# EAGLE design Firefly Mainboard (EAGLE 8.2.0)
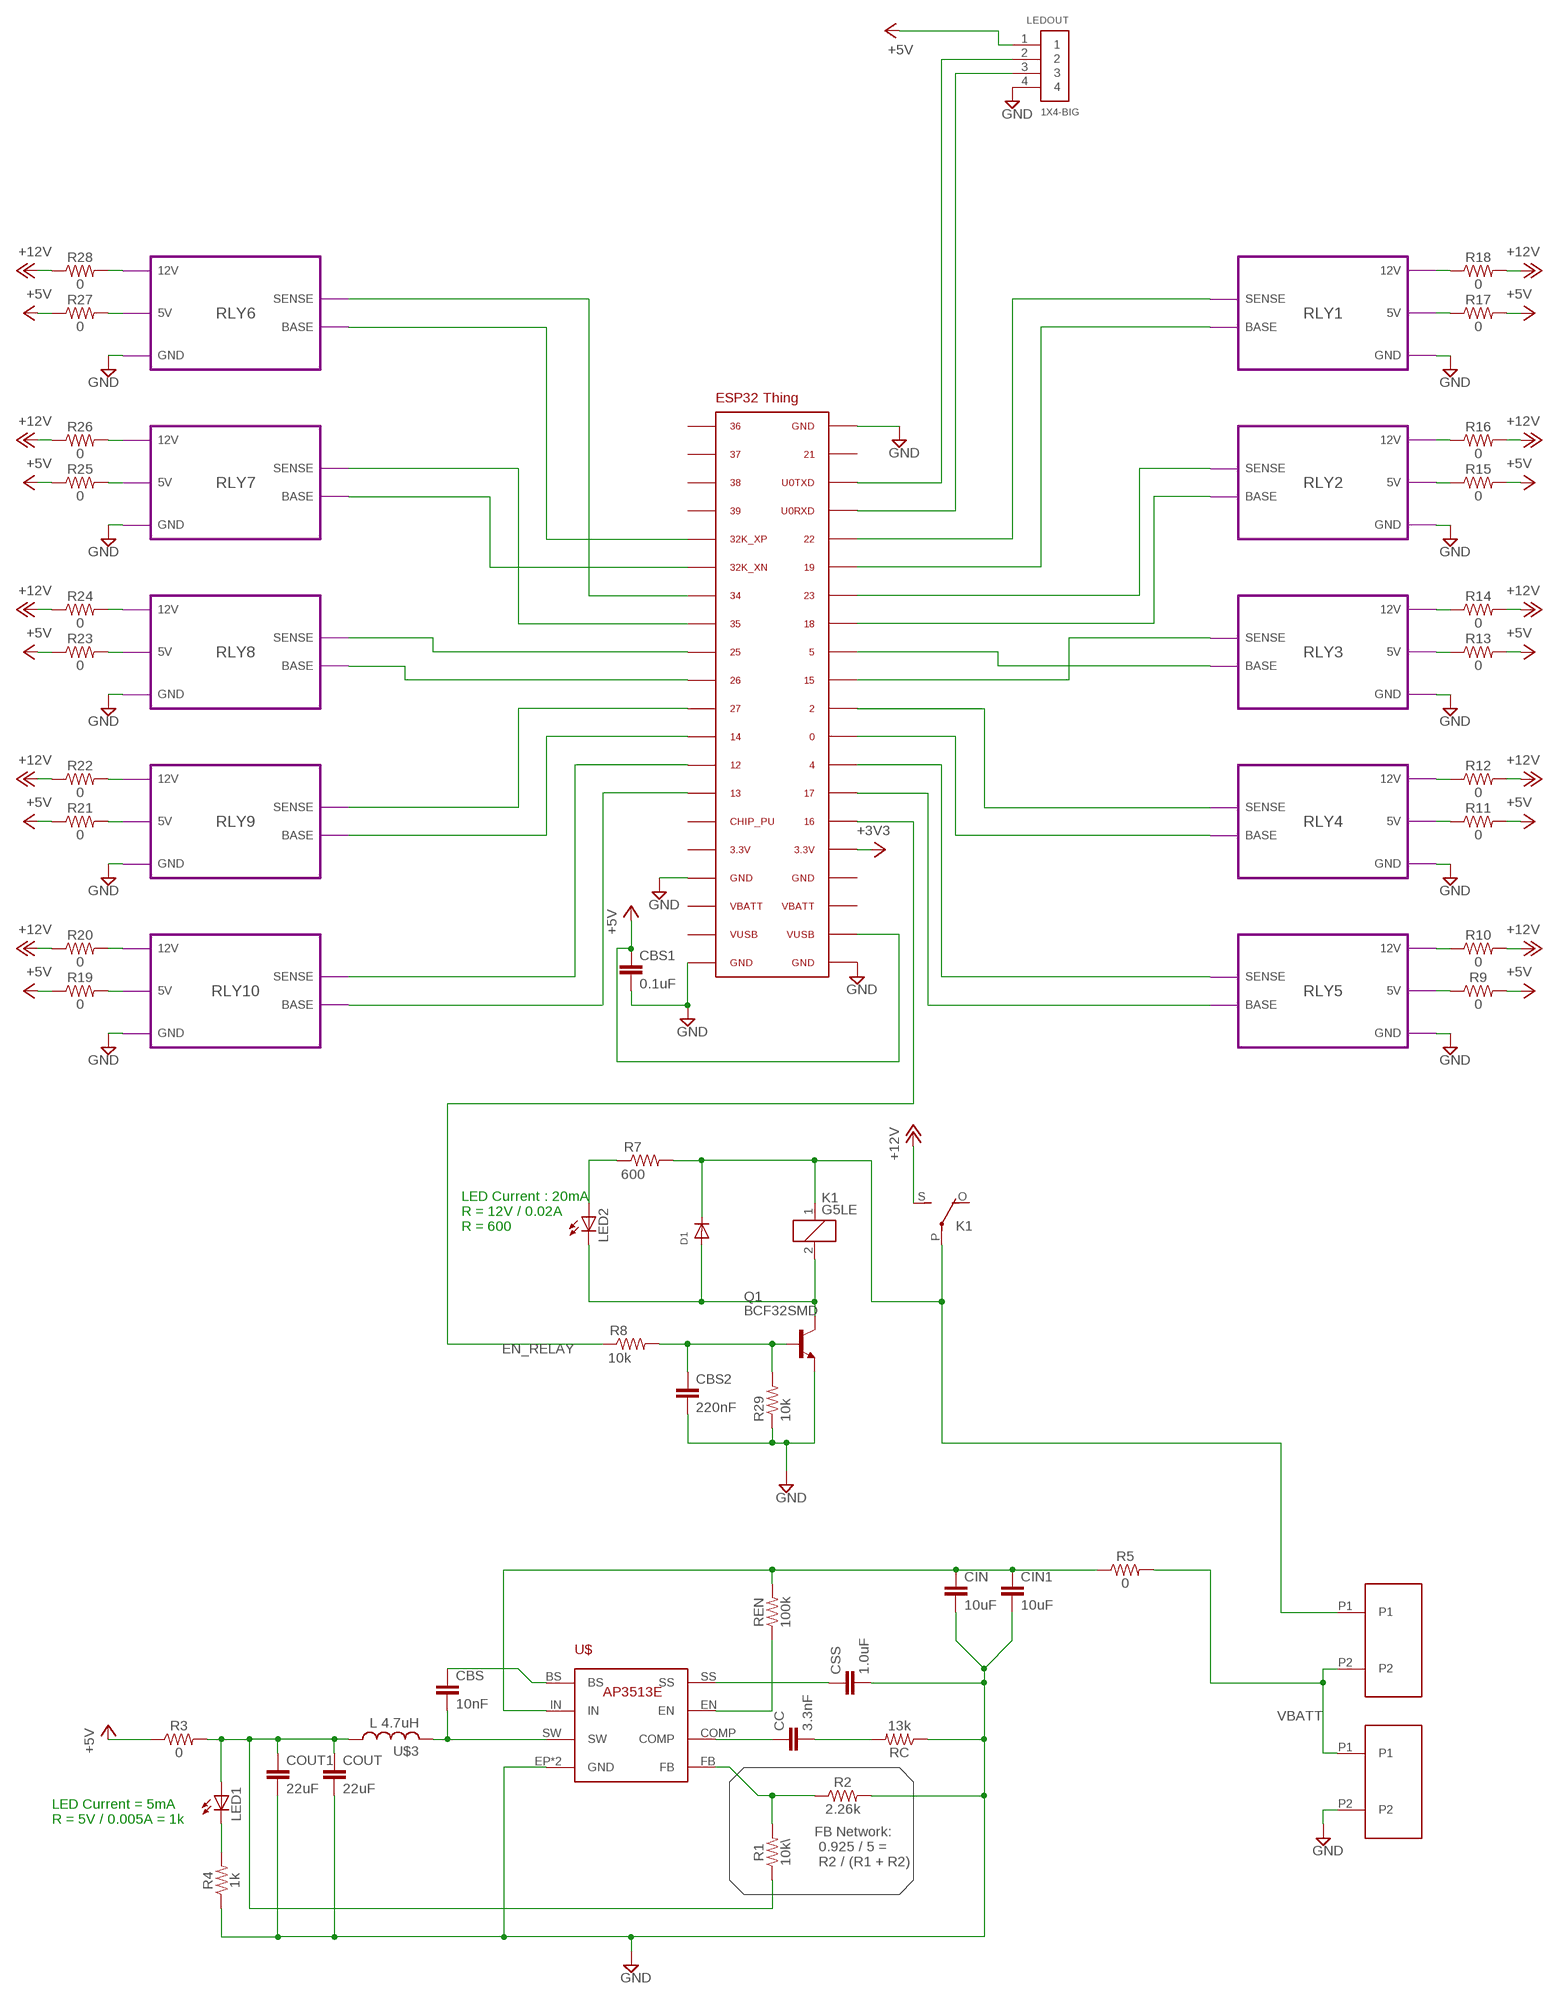
[diagram p0: schematic, sheet 1]

## Parts
CBS  10nF  1.0UF-1206-50V-10%  [1206]
CBS1  0.1uF  1.0UF-1206-50V-10%  [1206]
CBS2  220nF  1.0UF-1206-50V-10%  [1206]
CC  3.3nF  1.0UF-1206-50V-10%  [1206]
CIN  10uF  1.0UF-1206-50V-10%  [1206]
CIN1  10uF  1.0UF-1206-50V-10%  [1206]
COUT  22uF  1.0UF-1206-50V-10%  [1206]
COUT1  22uF  1.0UF-1206-50V-10%  [1206]
CSS  1.0uF  1.0UF-1206-50V-10%  [1206]
D1  DIODESMA  [SMADIODE]
K1  G5LE  [G5LE]
LED1  LED_ESML0603  [LED_SML0603]
LED2  LED_ESML0603  [LED_SML0603]
LEDOUT  1X4-BIG  [1X04-BIG]
Q1  BCF32SMD  [SOT23-BEC]
R1  10k\  1KOHM-0603-1/10W-1%  [0603]
R2  2.26k  1KOHM-0603-1/10W-1%  [0603]
R3  0  RESISTOR1206  [1206]
R4  1k  1KOHM-0603-1/10W-1%  [0603]
R5  0  RESISTOR1206  [1206]
R7  R-US_R0603  [R0603]
R8  R-US_R0603  [R0603]
R9  0  RESISTOR1206  [1206]
R10  0  RESISTOR1206  [1206]
R11  0  RESISTOR1206  [1206]
R12  0  RESISTOR1206  [1206]
R13  0  RESISTOR1206  [1206]
R14  0  RESISTOR1206  [1206]
R15  0  RESISTOR1206  [1206]
R16  0  RESISTOR1206  [1206]
R17  0  RESISTOR1206  [1206]
R18  0  RESISTOR1206  [1206]
R19  0  RESISTOR1206  [1206]
R20  0  RESISTOR1206  [1206]
R21  0  RESISTOR1206  [1206]
R22  0  RESISTOR1206  [1206]
R23  0  RESISTOR1206  [1206]
R24  0  RESISTOR1206  [1206]
R25  0  RESISTOR1206  [1206]
R26  0  RESISTOR1206  [1206]
R27  0  RESISTOR1206  [1206]
R28  0  RESISTOR1206  [1206]
R29  10k  R-US_R0603  [R0603]
RC  13k  1KOHM-0603-1/10W-1%  [0603]
REN  100k  1KOHM-0603-1/10W-1%  [0603]
U$1  ESP32_THING  [ESP32_THING]
U$2  AP3513E  [AP3513E]
U$3  L 4.7uH  LL1210  [R1210]
U$4  BATTERY_PADS  [BATTERY_PADS]
U$5  BATTERY_PADS  [BATTERY_PADS]

## Module instances
RLY1 = RELAY
RLY2 = RELAY
RLY3 = RELAY
RLY4 = RELAY
RLY5 = RELAY
RLY6 = RELAY
RLY7 = RELAY
RLY8 = RELAY
RLY9 = RELAY
RLY10 = RELAY

## Nets
+3V3: U$1.P$5
+5V: CBS1.1 LEDOUT.1 R3.1 R9.2 R11.2 R13.2 R15.2 R17.2 R19.1 R21.1 R23.1 R25.1 R27.1 U$1.P$2
+12V: K1.S(2:S) R10.2 R12.2 R14.2 R16.2 R18.2 R20.1 R22.1 R24.1 R26.1 R28.1
EN_RELAY: R8.1 U$1.P$6
GND: CBS1.2 CBS2.2 CIN1.2 CIN.2 COUT1.2 COUT.2 CSS.2 LEDOUT.4 Q1.E R2.2 R4.1 R29.1 RC.1 U$1.P$1 U$1.P$20 U$1.P$21 U$1.P$24 U$2.EP(GND) U$2.GND U$4.P2 ; port RLY1.GND RLY2.GND RLY3.GND RLY4.GND RLY5.GND RLY6.GND RLY7.GND RLY8.GND RLY9.GND RLY10.GND
N$1: R1.2 R2.1 U$2.FB
N$2: CC.1 U$2.COMP
N$3: CC.2 RC.2
N$4: CSS.1 U$2.SS
N$5: REN.1 U$2.EN
N$6: LEDOUT.2 U$1.P$18
N$7: CBS.2 U$2.SW U$3.2
N$8: CBS.1 U$2.BS
N$10: U$1.P$7 ; port RLY5.BASE
N$11: U$1.P$8 ; port RLY5.SENSE
N$12: U$1.P$9 ; port RLY4.BASE
N$13: U$1.P$10 ; port RLY4.SENSE
N$14: U$1.P$12 ; port RLY3.BASE
N$15: U$1.P$11 ; port RLY3.SENSE
N$16: U$1.P$13 ; port RLY2.BASE
N$17: U$1.P$14 ; port RLY2.SENSE
N$18: U$1.P$27 ; port RLY10.BASE
N$19: U$1.P$28 ; port RLY10.SENSE
N$20: U$1.P$29 ; port RLY9.BASE
N$21: U$1.P$30 ; port RLY9.SENSE
N$22: U$1.P$31 ; port RLY8.BASE
N$23: U$1.P$32 ; port RLY8.SENSE
N$24: U$1.P$35 ; port RLY7.BASE
N$25: U$1.P$33 ; port RLY7.SENSE
N$26: U$1.P$36 ; port RLY6.BASE
N$27: U$1.P$34 ; port RLY6.SENSE
N$28: COUT1.1 COUT.1 LED1.A R1.1 R3.2 U$3.1
N$29: LED1.C R4.2
N$30: D1.A K1.2 LED2.C Q1.C
N$31: U$1.P$15 ; port RLY1.BASE
N$32: CIN1.1 CIN.1 R5.1 REN.2 U$2.IN
N$34: LED2.A R7.1
N$35: R10.1 ; port RLY5.12V
N$36: R9.1 ; port RLY5.5V
N$37: R11.1 ; port RLY4.5V
N$38: R12.1 ; port RLY4.12V
N$39: R13.1 ; port RLY3.5V
N$40: R14.1 ; port RLY3.12V
N$41: R15.1 ; port RLY2.5V
N$42: R16.1 ; port RLY2.12V
N$43: R17.1 ; port RLY1.5V
N$44: R18.1 ; port RLY1.12V
N$45: R19.2 ; port RLY10.5V
N$46: R20.2 ; port RLY10.12V
N$47: R21.2 ; port RLY9.5V
N$48: R22.2 ; port RLY9.12V
N$49: R23.2 ; port RLY8.5V
N$50: R24.2 ; port RLY8.12V
N$51: R25.2 ; port RLY7.5V
N$52: R26.2 ; port RLY7.12V
N$53: R27.2 ; port RLY6.5V
N$54: R28.2 ; port RLY6.12V
N$55: U$1.P$16 ; port RLY1.SENSE
N$57: D1.C K1.1 K1.P(2:P) R7.2 U$5.P1
N$58: CBS2.1 Q1.B R8.2 R29.2
SCL: LEDOUT.3 U$1.P$17
VBATT: R5.2 U$4.P1 U$5.P2
Unconnected: K1.O(2:O) U$1.P$3 U$1.P$4 U$1.P$19 U$1.P$22 U$1.P$23 U$1.P$25 U$1.P$26 U$1.P$37 U$1.P$38 U$1.P$39 U$1.P$40

## Notes on the sheet
- LED Current : 20mA
  R = 12V / 0.02A 
  R = 600
- LED Current = 5mA
  R = 5V / 0.005A = 1k
- FB Network:
   0.925 / 5 =
   R2 / (R1 + R2)

## Library data of the parts
CBS CBS1 CBS2 CC CIN CIN1 COUT COUT1 = SparkFun-Capacitors:1.0UF: 1µF ceramic capacitors A capacitor is a passive two-terminal electrical component used to store electrical energy temporarily in an electric field.; PROD_ID: CAP-09822; VALUE: 1.0uF
CSS = SparkFun-Capacitors:1.0UF: 1µF ceramic capacitors A capacitor is a passive two-terminal electrical component used to store electrical energy temporarily in an electric field.; PROD_ID: CAP-09822
D1 = adafruit:DIODE: Diode SMADIODE - SMA Surface Mount Package 20V 1A Schottky Diode Digikey: 641-1014-6-ND DO-1N4148 - Through Hole Small Current Diode SOD-123 20V 1 A (.5mV Vf) Schottky Diode - Digikey: MBRX120TPMSCT-ND SOD-323 10V 570mA (.38mV Vf, 3ns) Schottky Diode - Digikey: ZLLS410CT-ND SOD-523 30V 30mA Schottky Diode (RB751S-40TE61) - Digikey: RB751S-40TE61CT-ND SOT23-R/W - SOT23 Package (R = Solder Paste/Reflow Ovens, W = Hand-Soldering) BAT54Film 40V 300mA - Digikey: 497-7162-1-ND
K1 = relay:G5LE: RELAY 1 x switch, 10 A/120 V AC, 8 A/30 V DC, Omron; OC_FARNELL: unknown; OC_NEWARK: unknown
LED1 LED2 = eagle-ltspice:LED_E: LED Source: http://www.osram.convergy.de Source: www.luxeon.com Source: www.kingbright.com; SPICEMODEL: NONE; SPICEPREFIX: D; SPICETYPE: diode
LEDOUT = adafruit:1X4: 4-pin connector
Q1 = transistor-npn:BCF32*: NPN Transistor
R1 R2 RC REN = SparkFun-Resistors:1KOHM: 1kΩ resistor A resistor is a passive two-terminal electrical component that implements electrical resistance as a circuit element. Resistors act to reduce current flow, and, at the same time, act to lower voltage levels within circuits. - Wikipedia; PROD_ID: RES-07856; VALUE: 1k
R3 R5 R9-R28 = SparkFun-Resistors:RESISTOR: Generic Resistor Package
R4 = SparkFun-Resistors:1KOHM: 1kΩ resistor A resistor is a passive two-terminal electrical component that implements electrical resistance as a circuit element. Resistors act to reduce current flow, and, at the same time, act to lower voltage levels within circuits. - Wikipedia; PROD_ID: RES-07856
R7 = resistor:R-US_: RESISTOR, American symbol; R1: 600
R8 = resistor:R-US_: RESISTOR, American symbol; R1: 10k
R29 = resistor:R-US_: RESISTOR, American symbol; R1: 1k
U$1 = Mylib:ESP32_THING: Sparkfun ESP32 Thing Wifi module with LiPo charger
U$2 = Mylib:AP3513E
U$3 = adafruit:L
U$4 U$5 = Mylib:BATTERY_PADS

## Module RELAY
Ports: SENSE(io) GND(io) 5V(io) 12V(io) BASE(io)
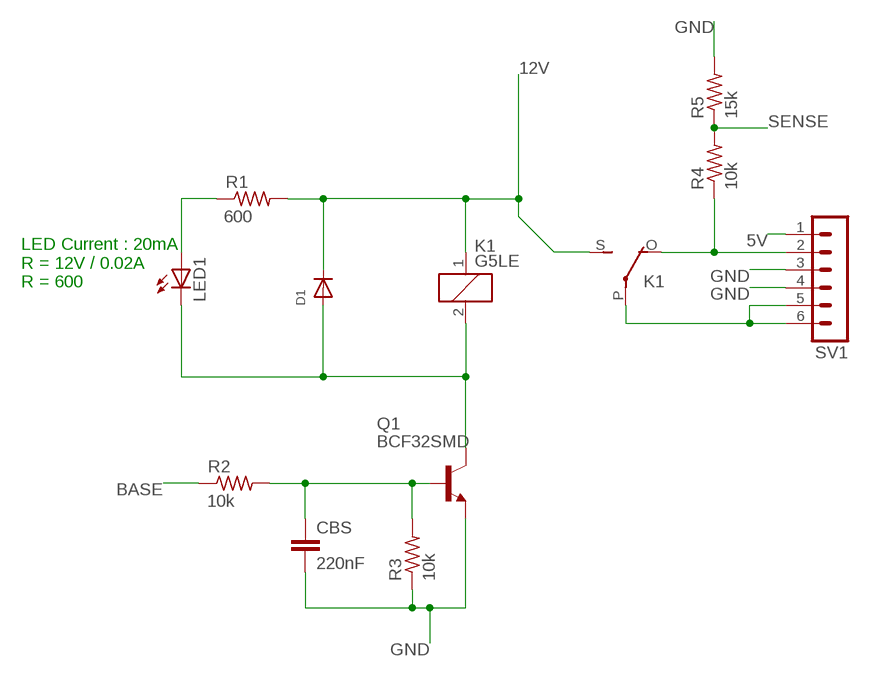
[diagram p1: schematic, module RELAY, sheet 1]

### Parts
CBS  220nF  1.0UF-1206-50V-10%  [1206]
D1  DIODESMA  [SMADIODE]
K1  G5LE  [G5LE]
LED1  LED_ESML0603  [LED_SML0603]
Q1  BCF32SMD  [SOT23-BEC]
R1  R-US_R0603  [R0603]
R2  R-US_R0603  [R0603]
R3  10k  R-US_R0603  [R0603]
R4  10k  R-US_R0603  [R0603]
R5  15k  R-US_R0603  [R0603]
SV1  MA06-1  [MA06-1]

### Nets
5V: SV1.1
12V: D1.C K1.1 K1.S(2:S) R1.2
BASE: R2.1
GND: CBS.2 Q1.E R3.1 R5.2 SV1.3 SV1.4
N$1: LED1.A R1.1
N$2: K1.P(2:P) SV1.5 SV1.6
N$3: CBS.1 Q1.B R2.2 R3.2
N$4: D1.A K1.2 LED1.C Q1.C
N$6: K1.O(2:O) R4.1 SV1.2
SENSE: R4.2 R5.1

### Notes on the sheet
- LED Current : 20mA
  R = 12V / 0.02A 
  R = 600

### Library data of the parts
CBS = SparkFun-Capacitors:1.0UF: 1µF ceramic capacitors A capacitor is a passive two-terminal electrical component used to store electrical energy temporarily in an electric field.; PROD_ID: CAP-09822; VALUE: 1.0uF
D1 = adafruit:DIODE: Diode SMADIODE - SMA Surface Mount Package 20V 1A Schottky Diode Digikey: 641-1014-6-ND DO-1N4148 - Through Hole Small Current Diode SOD-123 20V 1 A (.5mV Vf) Schottky Diode - Digikey: MBRX120TPMSCT-ND SOD-323 10V 570mA (.38mV Vf, 3ns) Schottky Diode - Digikey: ZLLS410CT-ND SOD-523 30V 30mA Schottky Diode (RB751S-40TE61) - Digikey: RB751S-40TE61CT-ND SOT23-R/W - SOT23 Package (R = Solder Paste/Reflow Ovens, W = Hand-Soldering) BAT54Film 40V 300mA - Digikey: 497-7162-1-ND
K1 = relay:G5LE: RELAY 1 x switch, 10 A/120 V AC, 8 A/30 V DC, Omron; OC_FARNELL: unknown; OC_NEWARK: unknown
LED1 = eagle-ltspice:LED_E: LED Source: http://www.osram.convergy.de Source: www.luxeon.com Source: www.kingbright.com; SPICEMODEL: NONE; SPICEPREFIX: D; SPICETYPE: diode
Q1 = transistor-npn:BCF32*: NPN Transistor
R1 = resistor:R-US_: RESISTOR, American symbol; R1: 600
R2 = resistor:R-US_: RESISTOR, American symbol; R1: 10k
R3-R5 = resistor:R-US_: RESISTOR, American symbol; R1: 1k
SV1 = con-lstb:MA06-1: PIN HEADER; OC_FARNELL: unknown; OC_NEWARK: unknown

## Module RELAY2
Ports: 

### Library data of the parts

## Board
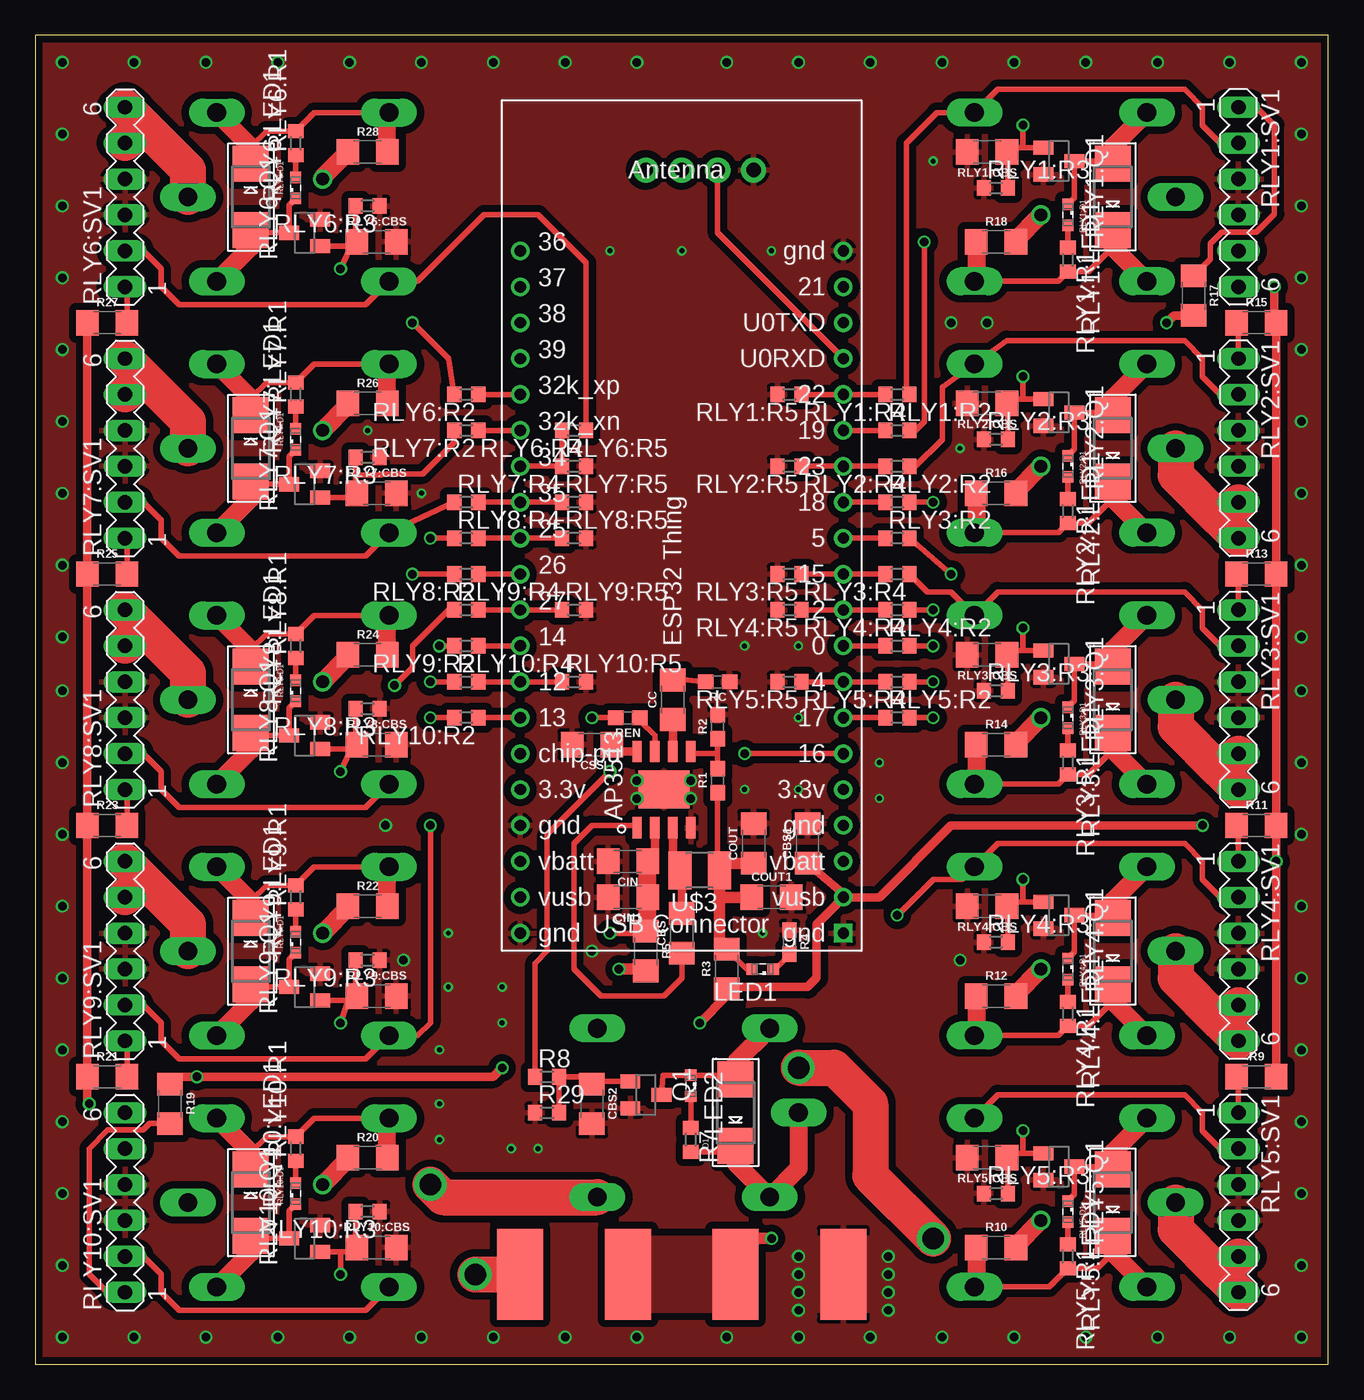
[diagram p2: board, top side]
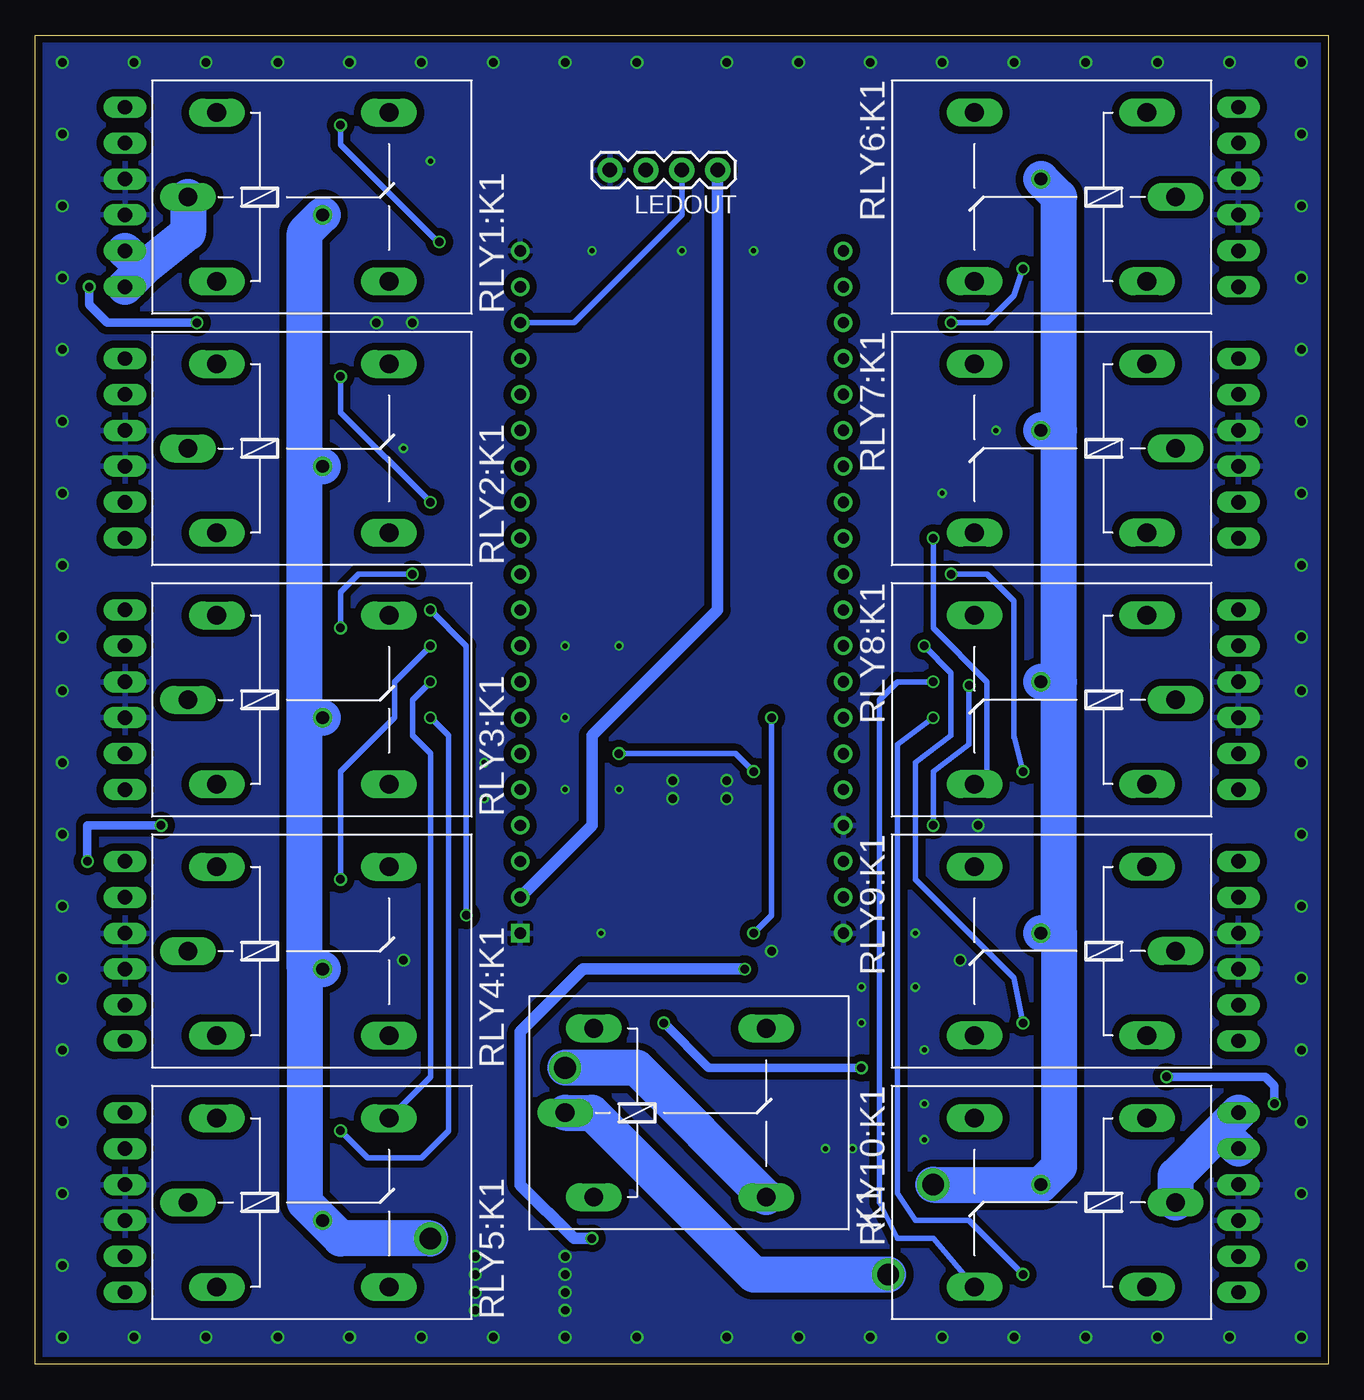
[diagram p3: board, bottom side, seen from below]

Size 91.44 x 93.98 mm. Coordinates in mm from the lower left corner, seen from the top.
Outline: 0,0 91.44,0 91.44,93.98 0,93.98 0,0
Copper layers (1*16): Top 0.035mm / dielectric 1.5mm / Bottom 0.035mm
Design rules "SeeedStudio_2layer_DRU_no_angle_20140221 *": minimum track width 6mil, minimum drill 12mil, track to track 10mil, track to pad 10mil, pad to pad 10mil, via to via 10mil, smd to smd 0mil, copper to edge 10mil, drill to drill 10mil, minimum pad ring 10mil, minimum via ring 6mil, stop-mask expansion 2mil, vias tented up to drill 100mil, thermal gap 10mil

### Footprints (pad centres in the part's own frame; a part is rotated, then mirrored left to right if it is on the bottom)
1206 = smd 1.6 x 1.8: 1 -1.4,0; 2 1.4,0
SMADIODE = smd 2.54 x 2.54: A 2.349,0; C -2.349,0
G5LE = drill 1.321 long: 1 -7.493,-5.969; 2 -7.493,5.969; O 4.699,5.969; P -9.525,0; S 4.699,-5.969
LED_SML0603 = smd 0.8 x 0.8: A 0.75,0; C -0.75,0
1X04-BIG = drill 1.016 pad 1.778: 1 0,0; 2 2.54,0; 3 5.08,0; 4 7.62,0
SOT23-BEC = smd 1 x 1.4: B -0.95,-1.1; C 0,1.1; E 0.95,-1.1
0603 = smd 1.1 x 1: 1 -0.85,0; 2 0.85,0
R0603 = smd 1 x 1.1: 1 -0.85,0; 2 0.85,0
MA06-1 = drill 1.016 long: 1 -6.35,0; 2 -3.81,0; 3 -1.27,0; 4 1.27,0; 5 3.81,0; 6 6.35,0
ESP32_THING = drill 0.8 square: P$1 0,0 | drill 0.8: P$2 0,2.54; P$3 0,5.08; P$4 0,7.62; P$5 0,10.16; P$6 0,12.7; P$7 0,15.24; P$8 0,17.78; P$9 0,20.32; P$10 0,22.86; P$11 0,25.4; P$12 0,27.94; P$13 0,30.48; P$14 0,33.02; P$15 0,35.56; P$16 0,38.1; P$17 0,40.64; P$18 0,43.18; P$19 0,45.72; P$20 0,48.26; P$21 -22.86,0; P$22 -22.86,2.54; P$23 -22.86,5.08; P$24 -22.86,7.62; P$25 -22.86,10.16; P$26 -22.86,12.7; P$27 -22.86,15.24; P$28 -22.86,17.78; P$29 -22.86,20.32; P$30 -22.86,22.86; P$31 -22.86,25.4; P$32 -22.86,27.94; P$33 -22.86,30.48; P$34 -22.86,33.02; P$35 -22.86,35.56; P$36 -22.86,38.1; P$37 -22.86,40.64; P$38 -22.86,43.18; P$39 -22.86,45.72; P$40 -22.86,48.26
AP3513E = smd 1.5 x 0.65: BS -2.7,1.905; COMP 2.7,-0.635; EN 2.7,0.635; FB 2.7,-1.905; GND -2.7,-1.905; IN -2.7,0.635; SS 2.7,1.905; SW -2.7,-0.635 | smd 2.7 x 3.6: EP 0,0
R1210 = smd 1.6 x 2.7: 1 -1.4,0; 2 1.4,0
BATTERY_PADS = smd 3.251 x 6.452: P1 -3.81,0; P2 3.81,0

### Placement (x,y rotation side)
CBS  45.72,30.48 90 top
CBS1  54.61,36.83 90 top
CBS2  39.37,18.41 270 top
CC  45.09,46.99 90 top
CIN  41.91,35.56 180 top
CIN1  41.91,33.02 180 top
COUT  50.8,36.83 90 top
COUT1  52.07,33.02 0 top
CSS  39.37,43.81 180 top
D1  49.53,17.78 90 top
K1  44.45,17.78 0 bottom
LED1  51.44,27.94 180 top
LED2  46.35,19.68 270 top
LEDOUT  43.18,84.45 180 bottom
Q1  43.18,19.05 270 top
R1  48.26,41.27 90 top
R2  48.26,45.09 90 top
R3  48.9,27.94 90 top
R4  53.34,29.84 270 top
R5  43.18,29.21 270 top
R7  46.35,15.88 270 top
R8  36.2,20.32 0 top
R9  86.36,20.32 0 top
R10  67.94,8.26 0 top
R11  86.36,38.1 0 top
R12  67.94,26.04 0 top
R13  86.36,55.88 0 top
R14  67.94,43.81 0 top
R15  86.36,73.66 0 top
R16  67.94,61.59 0 top
R17  81.92,75.56 270 top
R18  67.94,79.38 0 top
R19  9.53,18.41 270 top
R20  23.5,14.61 0 top
R21  5.08,20.32 0 top
R22  23.5,32.38 0 top
R23  5.08,38.1 0 top
R24  23.5,50.16 0 top
R25  5.08,55.88 0 top
R26  23.5,67.94 0 top
R27  5.08,73.66 0 top
R28  23.5,85.72 0 top
R29  36.2,17.78 0 top
RC  48.26,48.26 180 top
REN  41.91,45.72 180 top
RLY1:CBS  220nF  [1206]  67.31,85.72 180 top
RLY1:D1  [SMADIODE]  76.2,82.55 90 top
RLY1:K1  G5LE  [G5LE]  71.12,82.55 0 bottom
RLY1:LED1  [LED_SML0603]  73.03,81.28 270 top
RLY1:Q1  BCF32SMD  [SOT23-BEC]  72.39,85.09 270 top
RLY1:R1  [R0603]  73.03,78.11 270 top
RLY1:R2  [R0603]  60.96,66.04 0 top
RLY1:R3  10k  [R0603]  67.94,83.19 0 top
RLY1:R4  10k  [R0603]  60.96,68.58 180 top
RLY1:R5  15k  [R0603]  53.34,68.58 180 top
RLY1:SV1  [MA06-1]  85.09,82.55 270 top
RLY2:CBS  220nF  [1206]  67.31,67.94 180 top
RLY2:D1  [SMADIODE]  76.2,64.77 90 top
RLY2:K1  G5LE  [G5LE]  71.12,64.77 0 bottom
RLY2:LED1  [LED_SML0603]  73.03,63.5 270 top
RLY2:Q1  BCF32SMD  [SOT23-BEC]  72.39,67.31 270 top
RLY2:R1  [R0603]  73.03,60.33 270 top
RLY2:R2  [R0603]  60.96,60.96 0 top
RLY2:R3  10k  [R0603]  67.94,65.41 0 top
RLY2:R4  10k  [R0603]  60.96,63.5 180 top
RLY2:R5  15k  [R0603]  53.34,63.5 180 top
RLY2:SV1  [MA06-1]  85.09,64.77 270 top
RLY3:CBS  220nF  [1206]  67.31,50.16 180 top
RLY3:D1  [SMADIODE]  76.2,46.99 90 top
RLY3:K1  G5LE  [G5LE]  71.12,46.99 0 bottom
RLY3:LED1  [LED_SML0603]  73.03,45.72 270 top
RLY3:Q1  BCF32SMD  [SOT23-BEC]  72.39,49.53 270 top
RLY3:R1  [R0603]  73.03,42.55 270 top
RLY3:R2  [R0603]  60.96,58.42 0 top
RLY3:R3  10k  [R0603]  67.94,47.62 0 top
RLY3:R4  10k  [R0603]  60.96,55.88 180 top
RLY3:R5  15k  [R0603]  53.34,55.88 180 top
RLY3:SV1  [MA06-1]  85.09,46.99 270 top
RLY4:CBS  220nF  [1206]  67.31,32.38 180 top
RLY4:D1  [SMADIODE]  76.2,29.21 90 top
RLY4:K1  G5LE  [G5LE]  71.12,29.21 0 bottom
RLY4:LED1  [LED_SML0603]  73.03,27.94 270 top
RLY4:Q1  BCF32SMD  [SOT23-BEC]  72.39,31.75 270 top
RLY4:R1  [R0603]  73.03,24.77 270 top
RLY4:R2  [R0603]  60.96,50.8 0 top
RLY4:R3  10k  [R0603]  67.94,29.84 0 top
RLY4:R4  10k  [R0603]  60.96,53.34 180 top
RLY4:R5  15k  [R0603]  53.34,53.34 180 top
RLY4:SV1  [MA06-1]  85.09,29.21 270 top
RLY5:CBS  220nF  [1206]  67.31,14.61 180 top
RLY5:D1  [SMADIODE]  76.2,11.43 90 top
RLY5:K1  G5LE  [G5LE]  71.12,11.43 0 bottom
RLY5:LED1  [LED_SML0603]  73.03,10.79 270 top
RLY5:Q1  BCF32SMD  [SOT23-BEC]  72.39,13.97 270 top
RLY5:R1  [R0603]  73.03,7.62 270 top
RLY5:R2  [R0603]  60.96,45.72 0 top
RLY5:R3  10k  [R0603]  67.94,12.06 0 top
RLY5:R4  10k  [R0603]  60.96,48.26 180 top
RLY5:R5  15k  [R0603]  53.34,48.26 180 top
RLY5:SV1  [MA06-1]  85.09,11.43 270 top
RLY6:CBS  220nF  [1206]  24.13,79.38 0 top
RLY6:D1  [SMADIODE]  15.24,82.55 270 top
RLY6:K1  G5LE  [G5LE]  20.32,82.55 180 bottom
RLY6:LED1  [LED_SML0603]  18.41,83.19 90 top
RLY6:Q1  BCF32SMD  [SOT23-BEC]  19.05,80.01 90 top
RLY6:R1  [R0603]  18.41,86.36 90 top
RLY6:R2  [R0603]  30.48,68.58 180 top
RLY6:R3  10k  [R0603]  23.5,81.92 180 top
RLY6:R4  10k  [R0603]  38.1,66.04 180 top
RLY6:R5  15k  [R0603]  38.1,63.5 0 top
RLY6:SV1  [MA06-1]  6.35,82.55 90 top
RLY7:CBS  220nF  [1206]  24.13,61.59 0 top
RLY7:D1  [SMADIODE]  15.24,64.77 270 top
RLY7:K1  G5LE  [G5LE]  20.32,64.77 180 bottom
RLY7:LED1  [LED_SML0603]  18.41,65.41 90 top
RLY7:Q1  BCF32SMD  [SOT23-BEC]  19.05,62.23 90 top
RLY7:R1  [R0603]  18.41,68.58 90 top
RLY7:R2  [R0603]  30.48,66.04 180 top
RLY7:R3  10k  [R0603]  23.5,64.14 180 top
RLY7:R4  10k  [R0603]  30.48,60.96 0 top
RLY7:R5  15k  [R0603]  38.1,60.96 0 top
RLY7:SV1  [MA06-1]  6.35,64.77 90 top
RLY8:CBS  220nF  [1206]  24.13,43.81 0 top
RLY8:D1  [SMADIODE]  15.24,46.99 270 top
RLY8:K1  G5LE  [G5LE]  20.32,46.99 180 bottom
RLY8:LED1  [LED_SML0603]  18.41,47.62 90 top
RLY8:Q1  BCF32SMD  [SOT23-BEC]  19.05,44.45 90 top
RLY8:R1  [R0603]  18.41,50.8 90 top
RLY8:R2  [R0603]  30.48,55.88 180 top
RLY8:R3  10k  [R0603]  23.5,46.35 180 top
RLY8:R4  10k  [R0603]  30.48,58.42 0 top
RLY8:R5  15k  [R0603]  38.1,58.42 0 top
RLY8:SV1  [MA06-1]  6.35,46.99 90 top
RLY9:CBS  220nF  [1206]  24.13,26.04 0 top
RLY9:D1  [SMADIODE]  15.24,29.21 270 top
RLY9:K1  G5LE  [G5LE]  20.32,29.21 180 bottom
RLY9:LED1  [LED_SML0603]  18.41,29.84 90 top
RLY9:Q1  BCF32SMD  [SOT23-BEC]  19.05,26.67 90 top
RLY9:R1  [R0603]  18.41,33.02 90 top
RLY9:R2  [R0603]  30.48,50.8 180 top
RLY9:R3  10k  [R0603]  23.5,28.57 180 top
RLY9:R4  10k  [R0603]  30.48,53.34 0 top
RLY9:R5  15k  [R0603]  38.1,53.34 0 top
RLY9:SV1  [MA06-1]  6.35,29.21 90 top
RLY10:CBS  220nF  [1206]  24.13,8.26 0 top
RLY10:D1  [SMADIODE]  15.24,11.43 270 top
RLY10:K1  G5LE  [G5LE]  20.32,11.43 180 bottom
RLY10:LED1  [LED_SML0603]  18.41,12.06 90 top
RLY10:Q1  BCF32SMD  [SOT23-BEC]  19.05,8.89 90 top
RLY10:R1  [R0603]  18.41,15.24 90 top
RLY10:R2  [R0603]  30.48,45.72 180 top
RLY10:R3  10k  [R0603]  23.5,10.79 180 top
RLY10:R4  10k  [R0603]  30.48,48.26 0 top
RLY10:R5  15k  [R0603]  38.1,48.26 0 top
RLY10:SV1  [MA06-1]  6.35,11.43 90 top
U$1  57.15,30.48 0 top
U$2  44.45,40.64 90 top
U$3  46.99,34.92 180 top
U$4  53.34,6.35 0 top
U$5  38.1,6.35 0 top

### Tracks (layer width: path | path; a pad name or v marks a point on that pad's centre or on a via)
+5V  (via drill 0.6)
  Top 0.61: CBS1.1 57.28,33.15 U$1.P$2 | U$1.P$2 55.24,31.11 55.24,27.3 54.61,26.67 49.02,26.67 R3.1 48.9,26.04 v46.99,24.13 | R9.2 v87.76,35.56 R11.2 R13.2 R15.2 87.63,73.79 v87.63,76.2 | v80.01,73.66 80.52,74.17 R17.2 | R27.1 R25.1 R23.1 R21.1 3.68,18.55 v3.81,18.41 | R19.1 10.03,20.32 v11.43,20.32 32.38,20.32 v33.02,20.95 | U$1.P$2 59.69,33.02 64.77,38.1 v82.55,38.1
  Bottom 0.61: v87.63,76.2 87.63,74.93 86.36,73.66 v80.01,73.66 | v3.81,18.41 3.81,19.68 4.45,20.32 v11.43,20.32 | v82.55,38.1 R11.2 v87.76,35.56 | v46.99,24.13 43.81,20.95 v33.02,20.95
  Bottom 0.813: U$1.P$2 52.07,38.1 52.07,44.45 43.18,53.34 LEDOUT.1
+12V  (via drill 0.9, 1.52)
  Top 1.27: v20.32,83.82 20.32,83.95 R28.1 | R26.1 22.09,67.81 v20.32,66.04 | R24.1 22.09,50.03 v20.32,48.26 | R22.1 22.09,32.26 v20.32,30.48 | R20.1 22.09,14.47 v20.32,12.7 | R10.2 69.34,8.38 v71.12,10.16 | R12.2 69.34,26.16 v71.12,27.94 | R14.2 69.34,43.95 v71.12,45.72 | R16.2 69.34,61.73 v71.12,63.5 | R18.2 69.34,79.5 v71.12,81.28
  Top 2.54: K1.S 28.83,11.81 v27.94,12.7 | v53.98,20.95 56.52,20.95 59.05,18.41 59.05,13.34 v63.5,8.89
  Bottom 2.54: v63.5,8.89 69.85,8.89 v71.12,10.16 72.39,11.43 72.39,27.94 | v27.94,12.7 v20.32,12.7 19.05,13.97 19.05,30.48 | K1.S 48.9,20.95 v53.98,20.95 | 19.05,48.26 19.05,66.04 | 19.05,30.48 19.05,48.26 | 19.05,66.04 19.05,82.55 v20.32,83.82 | v20.32,66.04 19.05,66.04 | v20.32,48.26 19.05,48.26 | v20.32,30.48 19.05,30.48 | 72.39,45.72 72.39,63.5 | 72.39,27.94 72.39,45.72 | 72.39,63.5 72.39,80.01 v71.12,81.28 | v71.12,63.5 72.39,63.5 | v71.12,45.72 72.39,45.72 | v71.12,27.94 72.39,27.94
EN_RELAY  (via drill 0.6)
  Top 0.406: U$1.P$6 v50.16,43.18 | R8.1 35.34,28.36 36.2,29.21 36.2,36.83 36.2,37.47 v40.64,41.91
  Bottom 0.406: v40.64,41.91 41.91,43.18 v50.16,43.18
GND  (via drill 0.35, 0.6)
  other vias: 42.55,41.27 42.55,40.01 46.35,41.27 46.35,40.01 26.04,28.57 64.77,73.66 67.31,73.66 24.77,38.1 65.41,28.57 53.98,7.62 53.98,6.35 53.98,5.08 53.98,3.81 60.33,3.81 60.33,5.08 60.33,6.35 60.33,7.62 39.37,29.21 1.91,92.08 6.99,92.08 12.06,92.08 17.14,92.08 22.23,92.08 27.3,92.08 32.38,92.08 37.47,92.08 42.55,92.08 48.9,92.08 53.98,92.08 59.05,92.08 64.14,92.08 69.22,92.08 74.3,92.08 79.38,92.08 84.45,92.08 89.53,92.08 89.53,87 89.53,81.92 89.53,76.83 89.53,71.75 89.53,66.67 89.53,61.59 89.53,56.52 89.53,51.44 89.53,47.62 89.53,42.55 89.53,37.47 89.53,32.38 89.53,27.3 89.53,22.23 89.53,17.14 89.53,12.06 89.53,6.99 89.53,1.91 84.45,1.91 79.38,1.91 74.3,1.91 69.22,1.91 64.14,1.91 59.05,1.91 53.98,1.91 48.9,1.91 42.55,1.91 37.47,1.91 32.38,1.91 27.3,1.91 22.23,1.91 17.14,1.91 12.06,1.91 6.99,1.91 1.91,1.91 1.91,6.99 1.91,12.06 1.91,17.14 1.91,22.23 1.91,27.3 1.91,32.38 1.91,37.47 1.91,42.55 1.91,47.62 1.91,51.44 1.91,56.52 1.91,61.59 1.91,66.67 1.91,71.75 1.91,76.83 1.91,81.92 1.91,87 40.64,78.74 45.72,78.74 52.07,78.74 50.16,50.8 53.98,50.8 53.98,45.72 50.16,40.64 53.98,40.64 51.44,30.48 65.41,64.77 28.57,15.88 33.66,15.24 35.56,15.24 28.57,18.41 28.57,22.23 33.02,24.13 33.02,26.67 29.21,26.67 29.21,30.48 63.5,85.09 59.69,42.55 59.69,40.01 27.3,61.59 23.5,66.04
  pour Top (isolate 0.508, rank 2): 0.64,93.34 0.64,0.64 90.81,0.64 90.81,93.34
  pour Bottom (isolate 0.508): 0.64,93.34 0.64,0.64 90.81,0.64 90.81,93.34
  pour Top (no thermals): 54.61,3.81 59.69,3.81 59.69,8.89 54.61,8.89
N$1
  Top 0.406: R1.2 48.26,43.18 | 48.26,43.18 R2.1 | 48.26,43.18 46.52,43.18 U$2.FB
N$2
  Top 0.61: U$2.COMP CC.1
N$3
  Top 0.406: RC.2 45.17,48.48 CC.2
N$4
  Top 0.61: CSS.1 40.77,43.34 U$2.SS
N$5
  Top 0.406: U$2.EN 43.81,44.45 42.76,45.51 REN.1
N$6
  Bottom 0.406: U$1.P$18 53.34,73.66 45.72,81.28 LEDOUT.2
N$7
  Top 0.61: CBS.2 45.72,34.92 U$3.2 45.09,34.92 U$2.SW
N$8
  Top 0.406: 45.45,29.35 CBS.1 45.72,27.3 44.45,26.04 40.01,26.04 38.1,27.94 38.1,36.83 39.37,38.1 42.38,38.1 U$2.BS
N$10
  Top 0.406: RLY5:R2.1 U$1.P$7
N$11
  Top 0.406: RLY5:R5.1 U$1.P$8 RLY5:R4.2
N$12
  Top 0.406: RLY4:R2.1 U$1.P$9
N$13
  Top 0.406: RLY4:R5.1 U$1.P$10 RLY4:R4.2
N$14
  Top 0.406: RLY3:R2.1 U$1.P$12
N$15
  Top 0.406: RLY3:R4.2 U$1.P$11 RLY3:R5.1
N$16
  Top 0.406: U$1.P$13 RLY2:R2.1
N$17
  Top 0.406: RLY2:R4.2 U$1.P$14 RLY2:R5.1
N$18
  Top 0.406: RLY10:R2.1 U$1.P$27
N$19
  Top 0.406: RLY10:R5.1 U$1.P$28 RLY10:R4.2
N$20
  Top 0.406: RLY9:R2.1 U$1.P$29
N$21
  Top 0.406: RLY9:R4.2 U$1.P$30 RLY9:R5.1
N$22
  Top 0.406: RLY8:R2.1 U$1.P$31
N$23
  Top 0.406: RLY8:R4.2 U$1.P$32 RLY8:R5.1
N$24
  Top 0.406: RLY7:R2.1 U$1.P$35
N$25
  Top 0.406: RLY7:R4.2 U$1.P$33 RLY7:R5.1
N$26
  Top 0.406: RLY6:R2.1 U$1.P$36
N$27
  Top 0.406: RLY6:R4.2 RLY6:R5.1 U$1.P$34
N$28
  Top 0.406: 48.39,40.3 R1.1 48.26,35.56 48.26,35.05 U$3.1 | 49.28,29.34 R3.2 50.3,27.94 LED1.A
  Top 0.813: 48.39,33.02 U$3.1 | 48.39,33.02 48.39,29.84 R3.2 | COUT1.1 48.39,33.02 | COUT.1 48.39,35.43 48.26,35.56
N$29
  Top 0.406: LED1.C 52.19,27.73 R4.2
N$30
  Top 0.406: D1.A 49.22,20.43 LED2.C 44.4,20.43 Q1.C
  Top 1.27: D1.A 49.53,21.34 K1.2
N$31
  Top 0.406: RLY1:R2.1 U$1.P$15
N$32  (via drill 0.6)
  Top 0.406: REN.2 v39.37,45.72 | v40.64,30.48 43.05,30.48 R5.1
  Top 0.61: U$2.IN 43.81,35.56 CIN.1
  Top 1.27: CIN1.1 CIN.1 | 43.18,32.89 CIN1.1 | R5.1 43.31,30.74 CIN1.1
  Bottom 0.406: v39.37,45.72 39.37,31.75 v40.64,30.48
N$34
  Top 0.406: LED2.A R7.1
N$35
  Top 0.406: RLY5:K1.S 71.72,5.46 RLY5:R1.2 75.1,6.77 76.2,7.87
  Top 0.61: 76.03,8.04 76.2,7.87
  Top 1.27: RLY5:D1.C 76.2,7.87 RLY5:K1.1 | R10.1 66.55,5.58 RLY5:K1.S
N$36
  Top 0.406: R9.1 85.09,20.19 RLY5:SV1.1
N$37
  Top 0.406: R11.1 85.09,37.97 RLY4:SV1.1
N$38
  Top 0.406: 76.2,25.65 74.46,23.91 RLY4:R1.2 72.35,23.24 RLY4:K1.S
  Top 1.27: RLY4:D1.C 76.2,25.65 RLY4:K1.1 | R12.1 66.55,23.36 RLY4:K1.S
N$39
  Top 0.406: R13.1 85.09,55.75 RLY3:SV1.1
N$40
  Top 0.406: 76.2,43.43 74.46,41.7 RLY3:R1.2 72.35,41.02 RLY3:K1.S
  Top 1.27: RLY3:D1.C 76.2,43.43 RLY3:K1.1 | R14.1 66.55,41.15 RLY3:K1.S
N$41
  Top 0.406: R15.1 85.09,73.53 RLY2:SV1.1
N$42
  Top 0.406: 76.2,61.21 74.46,59.48 RLY2:R1.2 72.35,58.8 RLY2:K1.S
  Top 1.27: RLY2:D1.C 76.2,61.21 RLY2:K1.1 | R16.1 66.55,58.92 RLY2:K1.S
N$43
  Top 0.406: R17.1 83.11,78.16 83.11,79.25 83.92,80.06 86.36,80.06 87.63,81.33 87.63,87.63 86.36,88.9 RLY1:SV1.1
N$44
  Top 0.406: 76.2,78.99 74.46,77.25 RLY1:R1.2 72.35,76.58 RLY1:K1.S
  Top 1.27: RLY1:D1.C 76.2,78.99 RLY1:K1.1 | R18.1 66.55,76.7 RLY1:K1.S
N$45
  Top 0.406: R19.2 8.07,17.02 7.62,16.56 5.13,16.56 3.81,15.24 3.81,6.35 5.08,5.08 RLY10:SV1.1
N$46
  Top 0.406: RLY10:K1.S 19.72,17.4 RLY10:R1.2 16.34,16.09 15.24,14.99
  Top 1.27: RLY10:D1.C 15.24,14.99 RLY10:K1.1 | R20.2 24.89,17.27 RLY10:K1.S
N$47
  Top 0.406: R21.2 6.48,22.73 RLY9:SV1.1
N$48
  Top 0.406: RLY9:K1.S 19.72,35.18 RLY9:R1.2 16.34,33.87 15.24,32.77
  Top 1.27: RLY9:D1.C 15.24,32.77 RLY9:K1.1 | R22.2 24.89,35.05 RLY9:K1.S
N$49
  Top 0.406: R23.2 6.48,40.51 RLY8:SV1.1
N$50
  Top 0.406: RLY8:K1.S 19.72,52.96 RLY8:R1.2 16.34,51.65 15.24,50.55
  Top 1.27: RLY8:D1.C 15.24,50.55 RLY8:K1.1 | R24.2 24.89,52.84 RLY8:K1.S
N$51
  Top 0.406: R25.2 6.48,58.29 RLY7:SV1.1
N$52
  Top 0.406: RLY7:K1.S 19.72,70.74 RLY7:R1.2 16.34,69.43 15.24,68.33
  Top 1.27: RLY7:D1.C 15.24,68.33 RLY7:K1.1 | R26.2 24.89,70.61 RLY7:K1.S
N$53
  Top 0.406: R27.2 6.48,76.07 RLY6:SV1.1
N$54
  Top 0.406: RLY6:K1.S 19.72,88.52 RLY6:R1.2 16.34,87.21 15.24,86.11
  Top 1.27: RLY6:D1.C 15.24,86.11 RLY6:K1.1 | R28.2 24.89,88.39 RLY6:K1.S
N$55
  Top 0.406: RLY1:R5.1 U$1.P$16 RLY1:R4.2
N$57  (via drill 1.52)
  Top 0.406: R7.2 49.12,15.03 D1.C
  Top 1.27: D1.C 49.53,14.22 K1.1 53.98,13.84 K1.P
  Top 2.54: v31.11,6.35 U$5.P1
  Bottom 2.54: K1.P 52.07,17.78 40.64,6.35 v31.11,6.35
N$58
  Top 0.406: R29.2 R8.2 38.87,20.32 CBS2.1 39.55,20 Q1.B
RLY1:N$1
  Top 0.406: RLY1:R1.1 RLY1:LED1.A
RLY1:N$2
  Bottom 2.54: RLY1:K1.P 80.64,80.01 83.82,77.47 | 83.82,77.47 RLY1:SV1.5 | 83.82,77.47 RLY1:SV1.6
RLY1:N$3  (via drill 0.6)
  Top 0.406: RLY1:CBS.1 arc-90 68.8,85 | RLY1:R2.2 62.23,66.04 62.87,66.67 v62.87,79.38 | 69.85,86.04 RLY1:Q1.B | 69.85,86.04 69.03,86.04 RLY1:CBS.1 | v69.85,87.63 69.85,86.04 | RLY1:R3.2 68.8,85.64 RLY1:CBS.1
  Bottom 0.406: v62.87,79.38 62.99,79.38 69.85,86.23 v69.85,87.63
RLY1:N$4
  Top 0.406: RLY1:LED1.C 73.49,82.5 RLY1:Q1.C 76.01,85.09 arc-90 RLY1:D1.A
  Top 1.27: RLY1:D1.A 76.2,86.11 RLY1:K1.2
RLY1:N$6
  Top 0.406: RLY1:SV1.2 83.82,86.36 82.55,87.63 82.55,88.9 81.28,90.17 68.07,90.17 RLY1:K1.O 63.75,88.52 61.59,86.36 61.59,68.8 RLY1:R4.1
RLY2:N$1
  Top 0.406: RLY2:R1.1 RLY2:LED1.A
RLY2:N$2
  Top 2.54: RLY2:K1.P 80.64,62.87 83.82,59.69 | 83.82,59.69 RLY2:SV1.6 | RLY2:SV1.5 83.82,59.69
RLY2:N$3  (via drill 0.6)
  Top 0.406: RLY2:CBS.1 68.8,67.22 | RLY2:R2.2 v63.5,60.96 | 69.85,68.26 RLY2:Q1.B | 69.85,68.26 69.03,68.26 RLY2:CBS.1 | RLY2:R3.2 68.8,67.86 RLY2:CBS.1 | v69.85,69.85 69.85,68.26
  Bottom 0.406: v63.5,60.96 69.85,67.31 v69.85,69.85
RLY2:N$4
  Top 0.406: RLY2:LED1.C 73.49,64.72 RLY2:Q1.C 76.01,67.31 arc-90 RLY2:D1.A
  Top 1.27: RLY2:D1.A 76.2,68.33 RLY2:K1.2
RLY2:N$6
  Top 0.406: RLY2:SV1.2 83.82,68.58 82.55,69.85 82.55,71.12 81.28,72.39 68.71,72.39 RLY2:K1.O 64.14,69.09 64.14,65.41 62.23,63.5 RLY2:R4.1
RLY3:N$1
  Top 0.406: RLY3:R1.1 RLY3:LED1.A
RLY3:N$2
  Top 2.54: RLY3:K1.P 80.64,45.09 83.82,41.91 | 83.82,41.91 RLY3:SV1.6 | RLY3:SV1.5 83.82,41.91
RLY3:N$3  (via drill 0.6)
  Top 0.406: RLY3:R2.2 v64.77,55.88 | 69.85,50.48 RLY3:Q1.B | 69.85,50.48 69.03,50.48 RLY3:CBS.1 68.8,50.08 RLY3:R3.2 68.71,47.71 | v69.85,52.07 69.85,50.48
  Bottom 0.406: v69.85,52.07 69.85,54.61 68.58,55.88 v64.77,55.88
RLY3:N$4
  Top 0.406: RLY3:LED1.C 73.49,46.94 RLY3:Q1.C 76.01,49.53 arc-90 RLY3:D1.A
  Top 1.27: RLY3:D1.A 76.2,50.55 RLY3:K1.2
RLY3:N$6
  Top 0.406: RLY3:SV1.2 83.82,50.8 82.55,52.07 82.55,53.34 81.28,54.61 68.07,54.61 RLY3:K1.O 64.77,54.61 63.08,54.61 RLY3:R4.1
RLY4:N$1
  Top 0.406: RLY4:R1.1 RLY4:LED1.A
RLY4:N$2
  Top 2.54: RLY4:K1.P 80.64,27.3 83.82,24.13 | 83.82,24.13 RLY4:SV1.6 | RLY4:SV1.5 83.82,24.13
RLY4:N$3  (via drill 0.6)
  Top 0.406: RLY4:R2.2 v63.5,50.8 | RLY4:R3.2 68.8,32.3 RLY4:CBS.1 69.03,32.7 69.85,32.7 | 69.85,32.7 RLY4:Q1.B | v69.85,34.29 69.85,32.7
  Bottom 0.406: v63.5,50.8 66.04,48.26 66.04,45.72 69.85,41.91 v69.85,34.29
RLY4:N$4
  Top 0.406: RLY4:LED1.C 73.49,29.16 RLY4:Q1.C 76.01,31.75 arc-90 RLY4:D1.A
  Top 1.27: RLY4:D1.A 76.2,32.77 RLY4:K1.2
RLY4:N$6  (via drill 0.6)
  Top 0.406: RLY4:SV1.2 83.82,33.02 82.55,34.29 82.55,35.56 81.28,36.83 68.07,36.83 RLY4:K1.O 65.53,34.29 63.5,34.29 v60.96,31.75 | v63.5,53.34 RLY4:R4.1
  Bottom 0.406: v60.96,31.75 60.96,50.8 v63.5,53.34
RLY5:N$1
  Top 0.406: RLY5:R1.1 RLY5:LED1.A
RLY5:N$2
  Top 2.54: RLY5:K1.P 80.64,9.53 83.82,6.35 | 83.82,6.35 RLY5:SV1.6 | RLY5:SV1.5 83.82,6.35
RLY5:N$3  (via drill 0.6)
  Top 0.406: v63.5,45.72 RLY5:R2.2 | 68.8,13.97 RLY5:R3.2 | 68.8,13.97 68.8,14.52 RLY5:CBS.1 | 69.85,14.92 RLY5:Q1.B | 69.85,14.92 68.9,14.92 68.58,15.24 68.58,14.19 68.8,13.97 | v69.85,16.51 69.85,14.92
  Bottom 0.406: v63.5,45.72 62.23,44.45 62.23,16.51 64.14,14.61 67.94,14.61 v69.85,16.51
RLY5:N$4
  Top 0.406: RLY5:LED1.C 73.49,12.01 RLY5:Q1.C 76.01,13.97 arc-90 RLY5:D1.A
  Top 0.61: 75.89,14.09 RLY5:D1.A
  Top 1.27: RLY5:D1.A 76.2,14.99 RLY5:K1.2
RLY5:N$6  (via drill 0.6)
  Top 0.406: RLY5:R4.1 v63.5,48.26 | RLY5:K1.O 68.07,19.05 81.28,19.05 82.55,17.78 82.55,16.51 83.82,15.24 RLY5:SV1.2
  Bottom 0.406: v63.5,48.26 64.77,46.99 64.77,44.45 63.5,43.18 63.5,20.32 RLY5:K1.O
RLY6:N$1
  Top 0.406: RLY6:R1.1 RLY6:LED1.A
RLY6:N$2
  Top 2.54: RLY6:K1.P 10.79,84.45 7.62,87.63 | 7.62,87.63 RLY6:SV1.6 | RLY6:SV1.5 7.62,87.63
RLY6:N$3  (via drill 0.6)
  Top 0.406: RLY6:R3.2 22.64,79.46 RLY6:CBS.1 | RLY6:CBS.1 22.41,79.06 RLY6:Q1.B | RLY6:R2.2 29.21,71.12 v26.67,73.66 | v21.59,77.47 22.23,78.87 RLY6:CBS.1
  Bottom 0.406: v26.67,73.66 24.13,73.66 22.23,75.56 v21.59,77.47
RLY6:N$4
  Top 0.406: RLY6:LED1.C 17.95,81.97 RLY6:Q1.C 15.43,80.01 arc-90 RLY6:D1.A
  Top 1.27: RLY6:D1.A 15.24,78.99 RLY6:K1.2
RLY6:N$6
  Top 0.406: RLY6:SV1.2 7.62,78.74 8.89,77.47 8.89,76.2 10.16,74.93 23.37,74.93 RLY6:K1.O 27.05,76.58 31.75,81.28 35.56,81.28 38.95,77.89 RLY6:R4.1
RLY7:N$1
  Top 0.406: RLY7:R1.1 RLY7:LED1.A
RLY7:N$2
  Top 2.54: RLY7:K1.P 10.79,66.67 7.62,69.85 | 7.62,69.85 RLY7:SV1.6 | RLY7:SV1.5 7.62,69.85
RLY7:N$3
  Top 0.406: 22.64,62.87 RLY7:R3.2 | 22.64,62.87 22.64,61.68 arc90 RLY7:CBS.1 22.41,61.28 RLY7:Q1.B | 22.64,62.87 24.45,62.87 24.54,62.95 27.39,62.95 29.63,65.19 RLY7:R2.2
RLY7:N$4
  Top 0.406: RLY7:D1.A arc90 15.43,62.23 RLY7:Q1.C 17.95,64.19 RLY7:LED1.C
  Top 1.27: RLY7:D1.A 15.24,61.21 RLY7:K1.2
RLY7:N$6
  Top 0.406: RLY7:SV1.2 7.62,60.96 8.89,59.69 8.89,58.42 10.16,57.15 23.37,57.15 RLY7:K1.O RLY7:R4.1
RLY8:N$1
  Top 0.406: RLY8:R1.1 RLY8:LED1.A
RLY8:N$2
  Top 2.54: RLY8:K1.P 10.79,48.9 7.62,52.07 | 7.62,52.07 RLY8:SV1.6 | RLY8:SV1.5 7.62,52.07
RLY8:N$3  (via drill 0.6)
  Top 0.406: RLY8:CBS.1 arc-90 22.64,43.9 RLY8:R3.2 22.86,46.57 | RLY8:CBS.1 22.41,43.5 RLY8:Q1.B | RLY8:R2.2 v26.67,55.88 | v21.59,41.91 22.23,43.31 RLY8:CBS.1
  Bottom 0.406: v26.67,55.88 24.13,55.88 22.23,53.98 22.23,44.45 | 22.23,44.45 22.23,44.32 | 22.23,44.45 v21.59,41.91
RLY8:N$4
  Top 0.406: RLY8:LED1.C 17.95,46.41 RLY8:Q1.C 15.43,44.45 arc-90 RLY8:D1.A
  Top 1.27: RLY8:D1.A 15.24,43.43 RLY8:K1.2
RLY8:N$6  (via drill 0.6)
  Top 0.406: RLY8:K1.O 23.37,39.37 10.16,39.37 8.89,40.64 8.89,41.91 7.62,43.18 RLY8:SV1.2 | RLY8:R4.1 v27.94,58.42
  Bottom 0.406: v27.94,58.42 27.94,52.07 24.13,48.26 24.13,41.91 RLY8:K1.O
RLY9:N$1
  Top 0.406: RLY9:R1.1 RLY9:LED1.A
RLY9:N$2
  Top 2.54: RLY9:K1.P 10.79,31.11 7.62,34.29 | 7.62,34.29 RLY9:SV1.6 | RLY9:SV1.5 7.62,34.29
RLY9:N$3  (via drill 0.6)
  Top 0.406: RLY9:R3.2 22.64,26.04 RLY9:CBS.1 | RLY9:CBS.1 22.73,25.72 RLY9:Q1.B | RLY9:R2.2 v28.57,50.8 | v21.59,24.13 22.23,26.04 RLY9:CBS.1
  Bottom 0.406: v28.57,50.8 26.67,48.9 26.67,44.45 29.21,42.55 29.21,34.29 22.23,27.3 v21.59,24.13
RLY9:N$4
  Top 0.406: RLY9:LED1.C 17.95,28.63 RLY9:Q1.C 15.43,26.67 arc-90 RLY9:D1.A
  Top 1.27: RLY9:D1.A 15.24,25.65 RLY9:K1.2
RLY9:N$6  (via drill 0.6)
  Top 0.406: RLY9:SV1.2 7.62,25.4 8.89,24.13 8.89,22.86 10.16,21.59 23.37,21.59 RLY9:K1.O 27.05,23.24 27.94,24.13 v27.94,38.1 | RLY9:R4.1 29.21,53.34 26.67,50.8 26.67,49.28 v25.4,48.01
  Bottom 0.406: v25.4,48.01 25.4,43.81 27.94,41.91 v27.94,38.1
RLY10:N$1
  Top 0.406: RLY10:R1.1 RLY10:LED1.A
RLY10:N$2
  Bottom 2.54: RLY10:K1.P 10.79,13.34 7.62,16.51 | 7.62,16.51 RLY10:SV1.6 | RLY10:SV1.5 7.62,16.51
RLY10:N$3  (via drill 0.6)
  Top 0.406: 21.59,7.94 22.41,7.94 RLY10:CBS.1 22.64,8.26 RLY10:R3.2 | 21.59,7.94 RLY10:Q1.B | v27.94,45.72 RLY10:R2.2 | v21.59,6.35 21.59,7.94
  Bottom 0.406: v27.94,45.72 30.48,43.81 30.48,12.06 29.21,10.16 25.4,10.16 v21.59,6.35
RLY10:N$4
  Top 0.406: RLY10:D1.A arc90 15.43,8.89 RLY10:Q1.C 17.95,10.85 RLY10:LED1.C
  Top 1.27: RLY10:D1.A 15.24,7.87 RLY10:K1.2
RLY10:N$6  (via drill 0.6)
  Top 0.406: RLY10:K1.O 23.37,3.81 10.16,3.81 8.89,5.08 8.89,6.35 7.62,7.62 RLY10:SV1.2 | v27.94,48.26 RLY10:R4.1
  Bottom 0.406: 29.21,48.26 v27.94,48.26 30.48,48.26 31.75,46.99 31.75,11.43 30.48,8.89 27.94,8.89 RLY10:K1.O
SCL
  Top 0.406: U$1.P$17 48.26,80.01 LEDOUT.3
VBATT  (via drill 0.6)
  Top 0.61: 49.53,8.89 U$4.P1
  Top 0.813: v52.07,8.89 49.53,8.89 | v41.27,27.94 43.05,27.94 arc-90 R5.2
  Bottom 0.813: v52.07,8.89 53.34,8.89 57.15,12.7 57.15,23.5 52.7,27.94 v41.27,27.94
  pour Top (no thermals): 41.91,8.89 50.8,8.89 50.8,3.81 41.91,3.81